# Altium schematic sheet M_Driver.SchDoc: M_Driver
size A4; Date: 12/02/2018; CheckedBy: Mr. Pauwels; Author: Robbie Smedts; CompanyName: KU Leuven; DrawnBy: Robbie Smedts; Engineer: Robbie Smedts & Vincent Agemans; Organization: KU Leuven; DocumentNumber: 4; Revision: 1; SheetNumber: 4; SheetTotal: 5; DocumentName: M_Driver
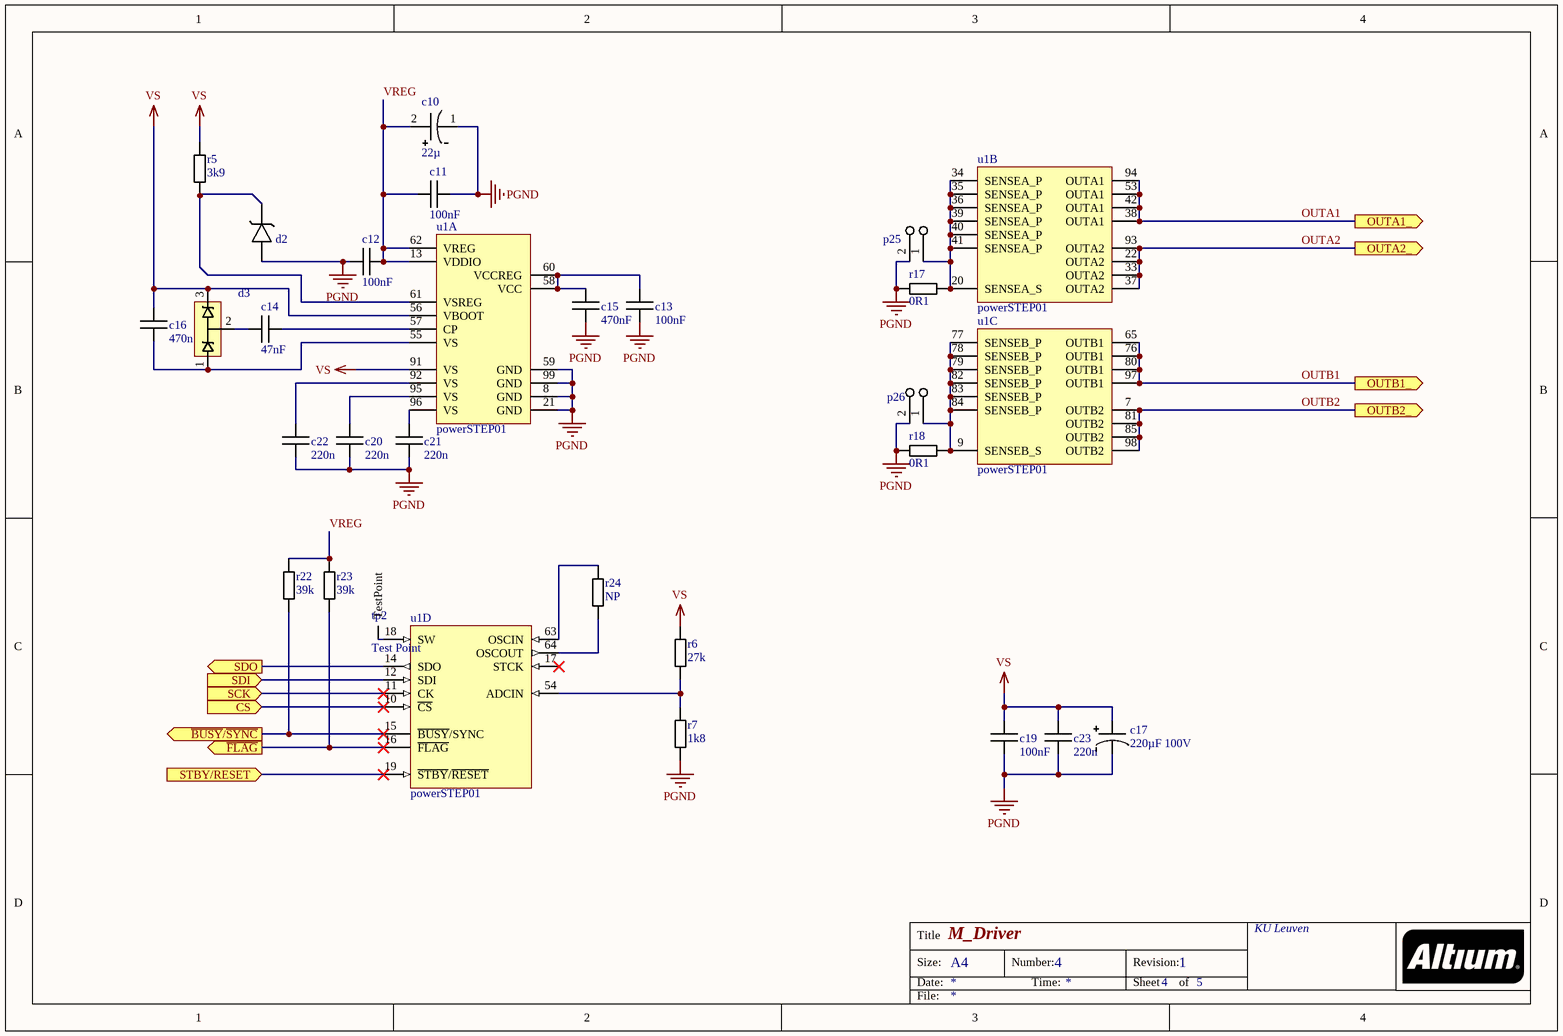
[diagram p0: M_Driver.SchDoc]

## Parts
c10  22µ  [Elco-B]
c11  100nF  [0805]
c12  100nF  [0805]
c13  100nF  [0805]
c14  47nF  [0805]
c15  470nF  [0805]
c16  470n  [0805]
c17  220µF 100V  [TH Elco 12.5]
c19  100nF  [0805]
c20  220n  [0805]
c21  220n  [0805]
c22  220n  [0805]
c23  220n  [0805]
d2  DZ2W22000L  [Mini2-F3-B]  (value not drawn)
d3  BAS40-04  [SOT23]  (value not drawn)
p25  2 Pin Header  [1x2-HeaderPin]  (value not drawn)
p26  2 Pin Header  [1x2-HeaderPin]  (value not drawn)
r5  3k9  [1206]
r6  27k  [0805]
r7  1k8  [0805]
r17  0R1  [2512]
r18  0R1  [2512]
r22  39k  [0805]
r23  39k  [0805]
r24  NP  [0603]
tp2  Test Point  [Test Point]
u1  powerSTEP01  [VFQFPN]  (parts A,B,C,D of 4)

## Ports
CS (in), OUTA1_ (out), OUTA2_ (out), OUTB1_ (out), OUTB2_ (out), SCK (in), SDI (in), SDO (out), STBY/RESET (in), ~{BUSY}/~{SYNC} (out), ~{FLAG} (out)

## Nets
PGND: c10.1 c11.1 c12.2 c13.1 c15.1 c17.1 c19.1 c20.2 c21.2 c22.2 c23.2 d2.2(Anode) p25.2 p26.2 r7.1 r17.1 r18.1 u1.8(GND) u1.21(GND) u1.59(GND) u1.99(GND)
VS: c16.1 c17.2 c19.2 c23.1 d3.3 r5.1 r6.2 u1.56(VBOOT) u1.91(VS)
~{BUSY}/~{SYNC}: r22.2 u1.15(~{BUSY}/SYNC) ; port ~{BUSY}/~{SYNC}
CS: u1.10(~{CS}) ; port CS
~{FLAG}: r23.2 u1.16(~{FLAG}) ; port ~{FLAG}
OUTA1: u1.38(OUTA1) u1.42(OUTA1) u1.53(OUTA1) u1.94(OUTA1) ; port OUTA1_
OUTA2: u1.22(OUTA2) u1.33(OUTA2) u1.37(OUTA2) u1.93(OUTA2) ; port OUTA2_
OUTB1: u1.65(OUTB1) u1.76(OUTB1) u1.80(OUTB1) u1.97(OUTB1) ; port OUTB1_
OUTB2: u1.7(OUTB2) u1.81(OUTB2) u1.85(OUTB2) u1.98(OUTB2) ; port OUTB2_
SCK: u1.11(CK) ; port SCK
SDI: u1.12(SDI) ; port SDI
SDO: u1.14(SDO) ; port SDO
STBY/RESET: u1.19(~{STBY}/~{RESET}) ; port STBY/RESET
VREG: c10.2 c11.2 c12.1 r22.1 r23.1 u1.13(VDDIO) u1.62(VREG)
Netc13_2: c13.2 c15.2 u1.58(VCC) u1.60(VCCREG)
Netc14_1: c14.1 d3.2
Netc14_2: c14.2 u1.57(CP)
Netc16_2: c16.2 d3.1 u1.55(VS)
Netc20_1: c20.1 u1.95(VS)
Netc21_1: c21.1 u1.96(VS)
Netc22_1: c22.1 u1.92(VS)
Netd2_1: d2.1(Kathode) r5.2 u1.61(VSREG)
Netp25_1: p25.1 r17.2 u1.20(SENSEA_S) u1.34(SENSEA_P) u1.35(SENSEA_P) u1.36(SENSEA_P) u1.39(SENSEA_P) u1.40(SENSEA_P) u1.41(SENSEA_P)
Netp26_1: p26.1 r18.2 u1.9(SENSEB_S) u1.77(SENSEB_P) u1.78(SENSEB_P) u1.79(SENSEB_P) u1.82(SENSEB_P) u1.83(SENSEB_P) u1.84(SENSEB_P)
Netr6_1: r6.1 r7.2 u1.54(ADCIN)
Netr24_1: r24.1 u1.64(OSCOUT)
Netr24_2: r24.2 u1.63(OSCIN)
Nettp2_1: tp2.1(TestPoint) u1.18(SW)

Not connected (* = marked no-connect by the designer): u1 17(STCK)*

## Notes on the sheet
- Title
- Size:
- Date:
- A4
- Number:
- Time:
- Revision:
- Sheet
- of
- File:

## Library data of the parts
c10 = Elco B
c11-c16 c19-c23 = 0805 Capacitor: ...F
c17 = Elco TH d12.5: d = 12.5mm
d2 = DZ2W22000L: Zener diode
r5 = 1206 Resistor: ..R
r6 r7 r22 r23 = 0805 Resistor: ...R
r17 r18 = 2512 Resistor: ..R
r24 = 0603 Resistor: ...R
u1 = powerSTEP01: VFQFPN